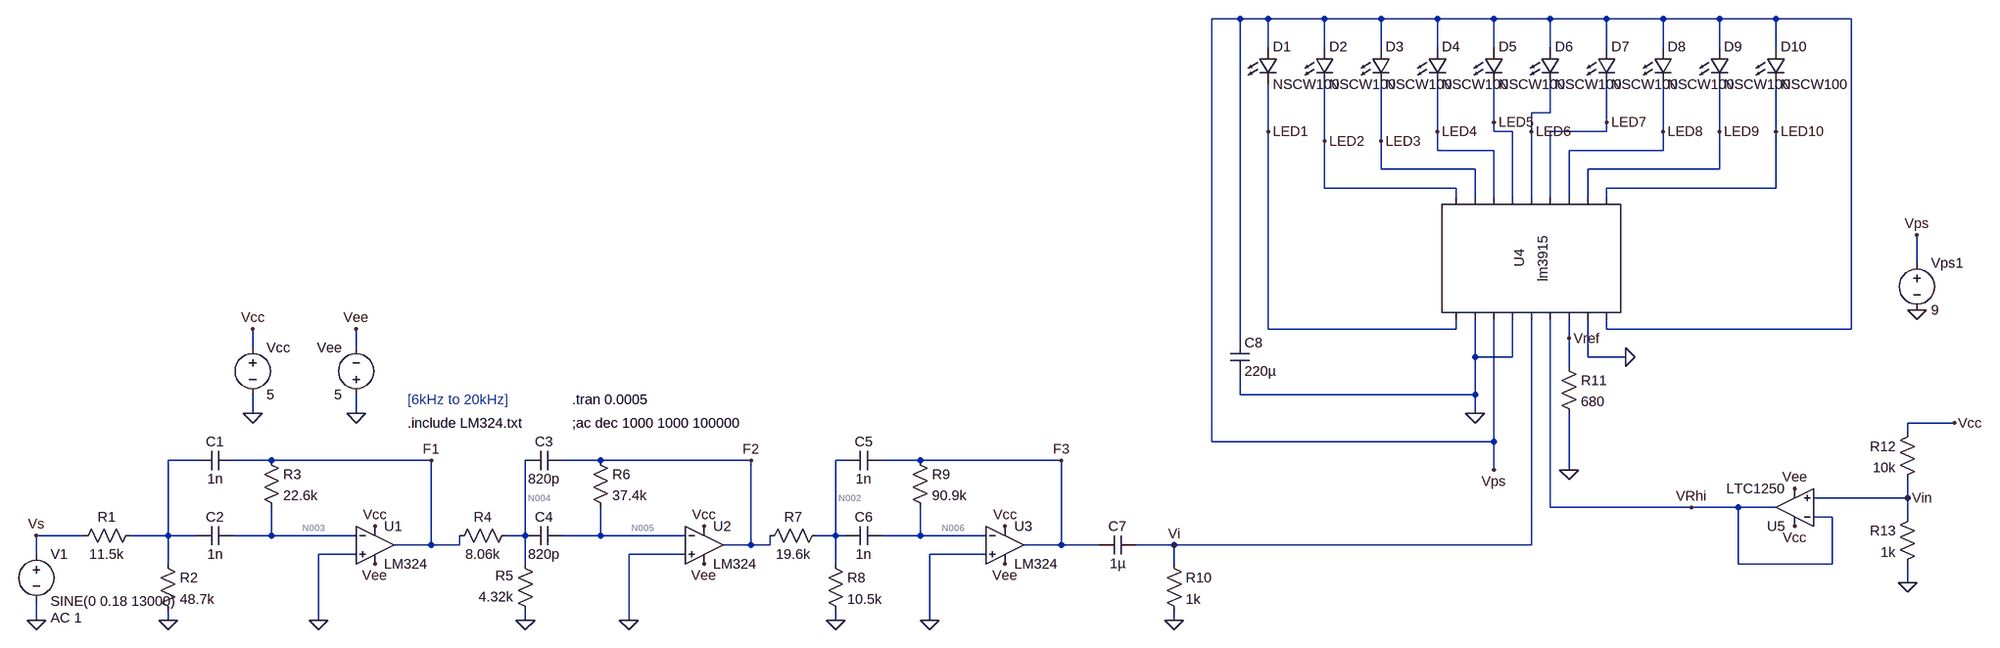
[diagram p0: schematic FinalBrillianceFilterWithLEDDriver.asc]
* FinalBrillianceFilterWithLEDDriver.asc
R1 N001 Vs 11.5k
V1 Vs 0 SINE(0 0.18 13000) AC 1
R3 F1 N003 22.6k
R4 N004 F1 8.06k
R5 0 N004 4.32k
R6 F2 N005 37.4k
R7 F2 N002 19.6k
R8 N002 0 10.5k
R9 F3 N006 90.9k
C1 F1 N001 1n
C2 N003 N001 1n
C3 F2 N004 820p
C4 N005 N004 820p
C5 F3 N002 1n
C6 N006 N002 1n
R2 N001 0 48.7k
Vcc Vcc 0 5
Vee 0 Vee 5
XU1 0 N003 Vcc Vee F1 LM324  ; pins In+ In- V+ V- OUT
XU2 0 N005 Vcc Vee F2 LM324  ; pins In+ In- V+ V- OUT
XU3 0 N006 Vcc Vee F3 LM324  ; pins In+ In- V+ V- OUT
C7 Vi F3 1µ
R10 Vi 0 1k
D1 Vps LED1 NSCW100
D2 Vps LED2 NSCW100
D3 Vps LED3 NSCW100
D4 Vps LED4 NSCW100
D5 Vps LED5 NSCW100
D6 Vps LED6 NSCW100
D7 Vps LED7 NSCW100
D8 Vps LED8 NSCW100
D9 Vps LED9 NSCW100
D10 Vps LED10 NSCW100
C8 Vps 0 220µ
Vps1 Vps 0 9
* U4: lm3915 (symbol AutoGenerated\lm3915 not available, pins judged from their places): pin1=LED1 pin2=0 pin3=Vps pin4=0 pin5=Vi pin6=VRhi pin7=Vref pin8=0 pin9=Vps pin10=LED2 pin11=LED3 pin12=LED4 pin13=LED5 pin14=LED6 pin15=LED7 pin16=LED8 pin17=LED9 pin18=LED10
R11 Vref 0 680
R12 Vcc Vin 10k
R13 Vin 0 1k
XU5 Vin VRhi Vcc Vee VRhi LTC1250  ; pins In+ In- V+ V- OUT
.model D D
.lib standard.dio
.tran 0.0005
;ac dec 1000 1000 100000
* [6kHz to 20kHz]
.include LM324.txt
.backanno
.end

* Results of the author's LTspice run, read from the files saved beside the schematic
* Operating Point, zero values left out:
*   V(f1) = -484.4 µV
*   V(n003) = -33.65 µV
*   V(n004) = -169 µV
*   V(f2) = -779.6 µV
*   V(n005) = -33.65 µV
*   V(n002) = -271.9 µV
*   V(f3) = -1.847 mV
*   V(n006) = -33.64 µV
*   V(vcc) = 5 V
*   V(vee) = -5 V
*   V(vi) = -25 µV
*   V(vps) = 9 V
*   V(led1) = 7.98 V
*   V(led2) = 7.98 V
*   V(led3) = 7.98 V
*   V(led4) = 7.98 V
*   V(led5) = 7.98 V
*   V(led6) = 7.98 V
*   V(led7) = 7.98 V
*   V(led8) = 7.98 V
*   V(led9) = 7.98 V
*   V(led10) = 7.98 V
*   V(vref) = 1.192 V
*   V(vrhi) = 454.5 mV
*   V(vin) = 454.5 mV
*   I(D10) = 1 µA
*   I(D9) = 1 µA
*   I(D8) = 1 µA
*   I(D7) = 1 µA
*   I(D6) = 1 µA
*   I(D5) = 1 µA
*   I(D4) = 1 µA
*   I(D3) = 1 µA
*   I(D2) = 1 µA
*   I(D1) = 1 µA
*   I(R13) = 454.5 µA
*   I(R12) = 454.5 µA
*   I(R11) = 1.753 mA
*   I(R10) = -25 nA
*   I(R9) = -19.94 nA
*   I(R8) = -25.9 nA
*   I(R7) = -25.9 nA
*   I(R6) = -19.94 nA
*   I(R5) = 39.13 nA
*   I(R4) = 39.13 nA
*   I(R3) = -19.94 nA
*   I(Vps1) = -10.45 mA
*   I(Vee) = -4.012 mA
*   I(Vcc) = -4.483 mA
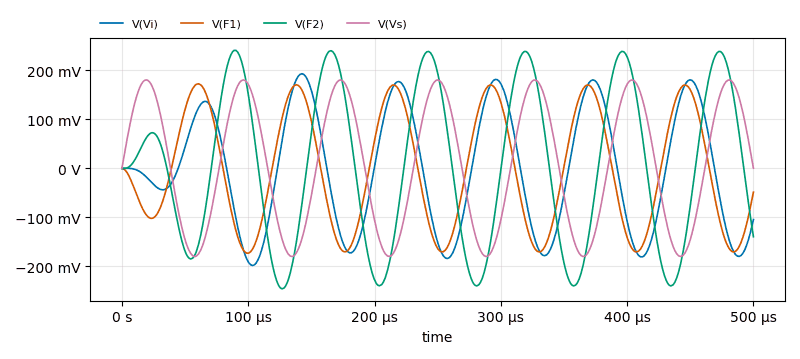
[diagram p1: Transient Analysis of FinalBrillianceFilterWithLEDDriver.asc, plotted from the saved traces]
* Transient Analysis, 1 run:
*   V(Vi): min -198.3 mV, max 192.6 mV, average -3.592 mV, rms 121.7 mV, last -104.7 mV
*   V(F1): min -173.3 mV, max 172.1 mV, average -4.466 mV, rms 117.7 mV, last -48.73 mV
*   V(F2): min -245.8 mV, max 240.2 mV, average 3.991 mV, rms 160.2 mV, last -139.7 mV
*   V(Vs): min -180 mV, max 180 mV, average 8.808 mV, rms 127.2 mV, last 0 V